# Altium schematic sheet Microcontroller.SchDoc
size A4
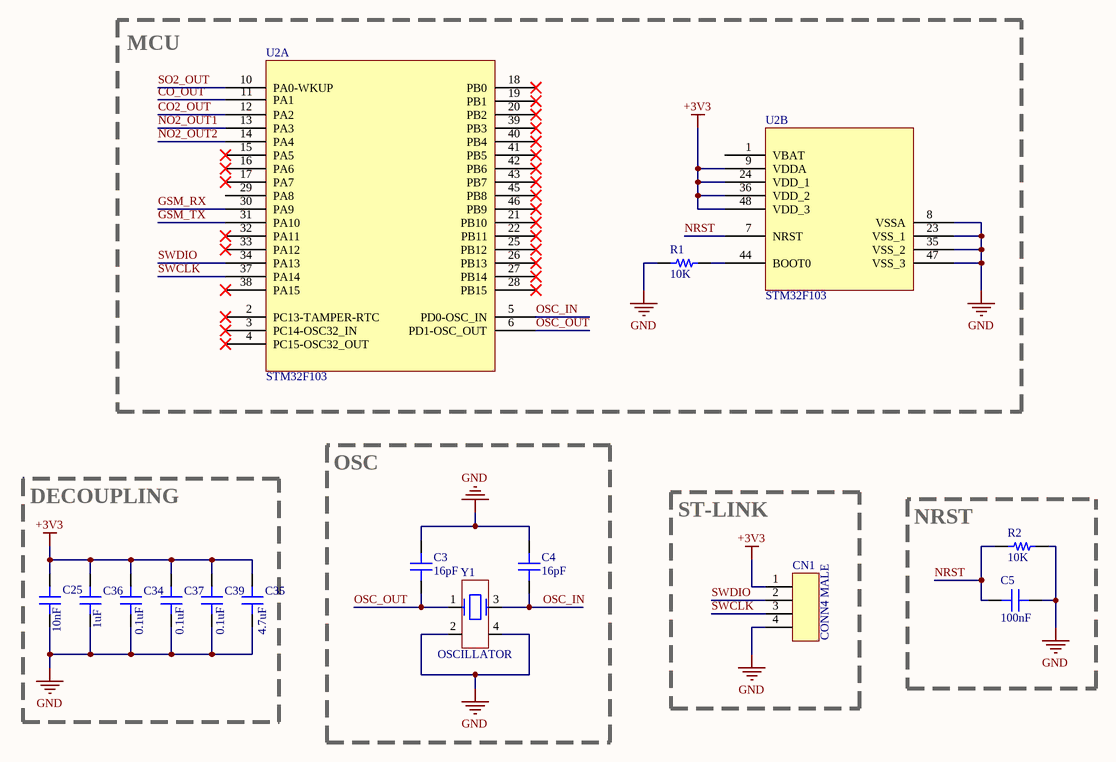
[diagram p0: Microcontroller.SchDoc]

## Parts
C3  16pF  [CAP 0603_1608]
C4  16pF  [CAP 0603_1608]
C5  100nF  [CAP 0603_1608]
C25  10nF  [CAP 0603_1608]
C34  0.1uF  [CAP 0603_1608]
C35  4.7uF  [CAP 0603_1608]
C36  1uF  [CAP 0603_1608]
C37  0.1uF  [CAP 0603_1608]
C39  0.1uF  [CAP 0603_1608]
CN1  CONN4 MALE  [CONN4 MALE]
R1  10K  [RES 0603_1608]
R2  10K  [RES 0603_1608]
U2  STM32F103  [LQFP48]  (parts A,B of 2)
Y1  OSCILLATOR  [OSCILLATOR]

## Blocks framed on the sheet
MCU: R1 U2
DECOUPLING: C25 C34-C37 C39
OSC: C3 C4 Y1
ST-LINK: CN1

## Nets
+3V3: C25.2 C34.2 C35.2 C36.2 C37.2 C39.2 CN1.1 U2.9(VDDA) U2.24(VDD_1) U2.36(VDD_2) U2.48(VDD_3)
GND: C3.2 C4.2 C5.1 C25.1 C34.1 C35.1 C36.1 C37.1 C39.1 CN1.4 R1.1 R2.2 U2.8(VSSA) U2.23(VSS_1) U2.35(VSS_2) U2.47(VSS_3) Y1.2 Y1.4
CO2_OUT: U2.12(PA2)
CO_OUT: U2.11(PA1)
GSM_RX: U2.30(PA9)
GSM_TX: U2.31(PA10)
NO2_OUT1: U2.13(PA3)
NO2_OUT2: U2.14(PA4)
NRST: C5.2 R2.1 U2.7(NRST)
OSC_IN: C4.1 U2.5(PD0-OSC_IN) Y1.3
OSC_OUT: C3.1 U2.6(PD1-OSC_OUT) Y1.1
SO2_OUT: U2.10(PA0-WKUP)
SWCLK: CN1.3 U2.37(PA14)
SWDIO: CN1.2 U2.34(PA13)
NetR1_2: R1.2 U2.44(BOOT0)

Not connected (* = marked no-connect by the designer): U2 1(VBAT) 2(PC13-TAMPER-RTC)* 3(PC14-OSC32_IN)* 4(PC15-OSC32_OUT)* 15(PA5)* 16(PA6)* 17(PA7)* 18(PB0)* 19(PB1)* 20(PB2)* 21(PB10)* 22(PB11)* 25(PB12)* 26(PB13)* 27(PB14)* 28(PB15)* 29(PA8) 32(PA11)* 33(PA12)* 38(PA15)* 39(PB3)* 40(PB4)* 41(PB5)* 42(PB6)* 43(PB7)* 45(PB8)* 46(PB9)*

## Notes on the sheet
- NRST

## Library data of the parts
C3 C4 = 16pF: CERAMİC 1206 SMD
C5 = 100nF: CERAMİC 1206 SMD
C25 = 10nF: CERAMİC 1206 SMD
C34 C37 C39 = 0.1uF: CERAMİC 1206 SMD
C35 = 4.7uF: CERAMİC 1206 SMD
C36 = 1uF: CERAMİC 1206 SMD
CN1 = CONN4 MALE: 4 PIN 2.54MM
R1 R2 = 10K: SMT RES 1206
U2 = STM32F103: STM32F103C8T6 SMD LQFP-48 32-Bit 72 MHz Mikrodenetleyici; ComponentLink1Description: F1Depo; ComponentLink1URL: https://www.f1depo.com/urun/stm32f103c8t6-smd-lqfp-48-32-bit-72-mhz-mikrodenetleyici; ComponentLink2Description: Datasheet; ComponentLink2URL: https://www.st.com/resource/en/datasheet/stm32f103c8.pdf
Y1 = OSCILLATOR: 8MHZ 12.5pF; ComponentLink1Description: Özdisan; ComponentLink1URL: https://ozdisan.com/pasif-komponentler/kristaller-osilatorler-ve-rezanatorler/kristaller/RH100-8-000-12-5-20150-E